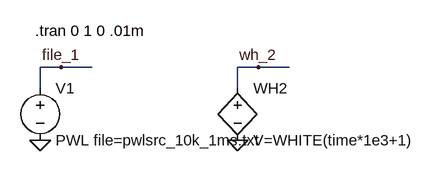
[diagram p0: schematic LM741_5b.asc]
LM741_5b.asc, the LTspice schematic file:
Version 4
SHEET 1 880 680
WIRE 160 64 128 64
WIRE 208 64 160 64
WIRE 464 64 432 64
WIRE 512 64 464 64
WIRE 128 96 128 64
WIRE 432 96 432 64
FLAG 160 64 file_1
FLAG 464 64 wh_2
FLAG 432 176 0
FLAG 128 176 0
SYMBOL bv 432 80 R0
SYMATTR InstName WH2
SYMATTR Value V=WHITE(time*1e3+1)
SYMBOL voltage 128 80 R0
WINDOW 123 0 0 Left 2
WINDOW 39 0 0 Left 2
SYMATTR InstName V1
SYMATTR Value PWL file=pwlsrc_10k_1ms.txt
TEXT 120 8 Left 2 !.tran 0 1 0 .01m

The netlist it stands for:
* LM741_5b.asc
B§WH2 wh_2 0 V=WHITE(time*1e3+1)
V1 file_1 0 PWL file=pwlsrc_10k_1ms.txt
.tran 0 1 0 .01m
.backanno
.end